# Altium schematic sheet Connectors_MILSPEC.SchDoc: Set in Document Options » Parameters » Title
size Tabloid; Author: Set in Document Options » Parameters » Author + Contact info
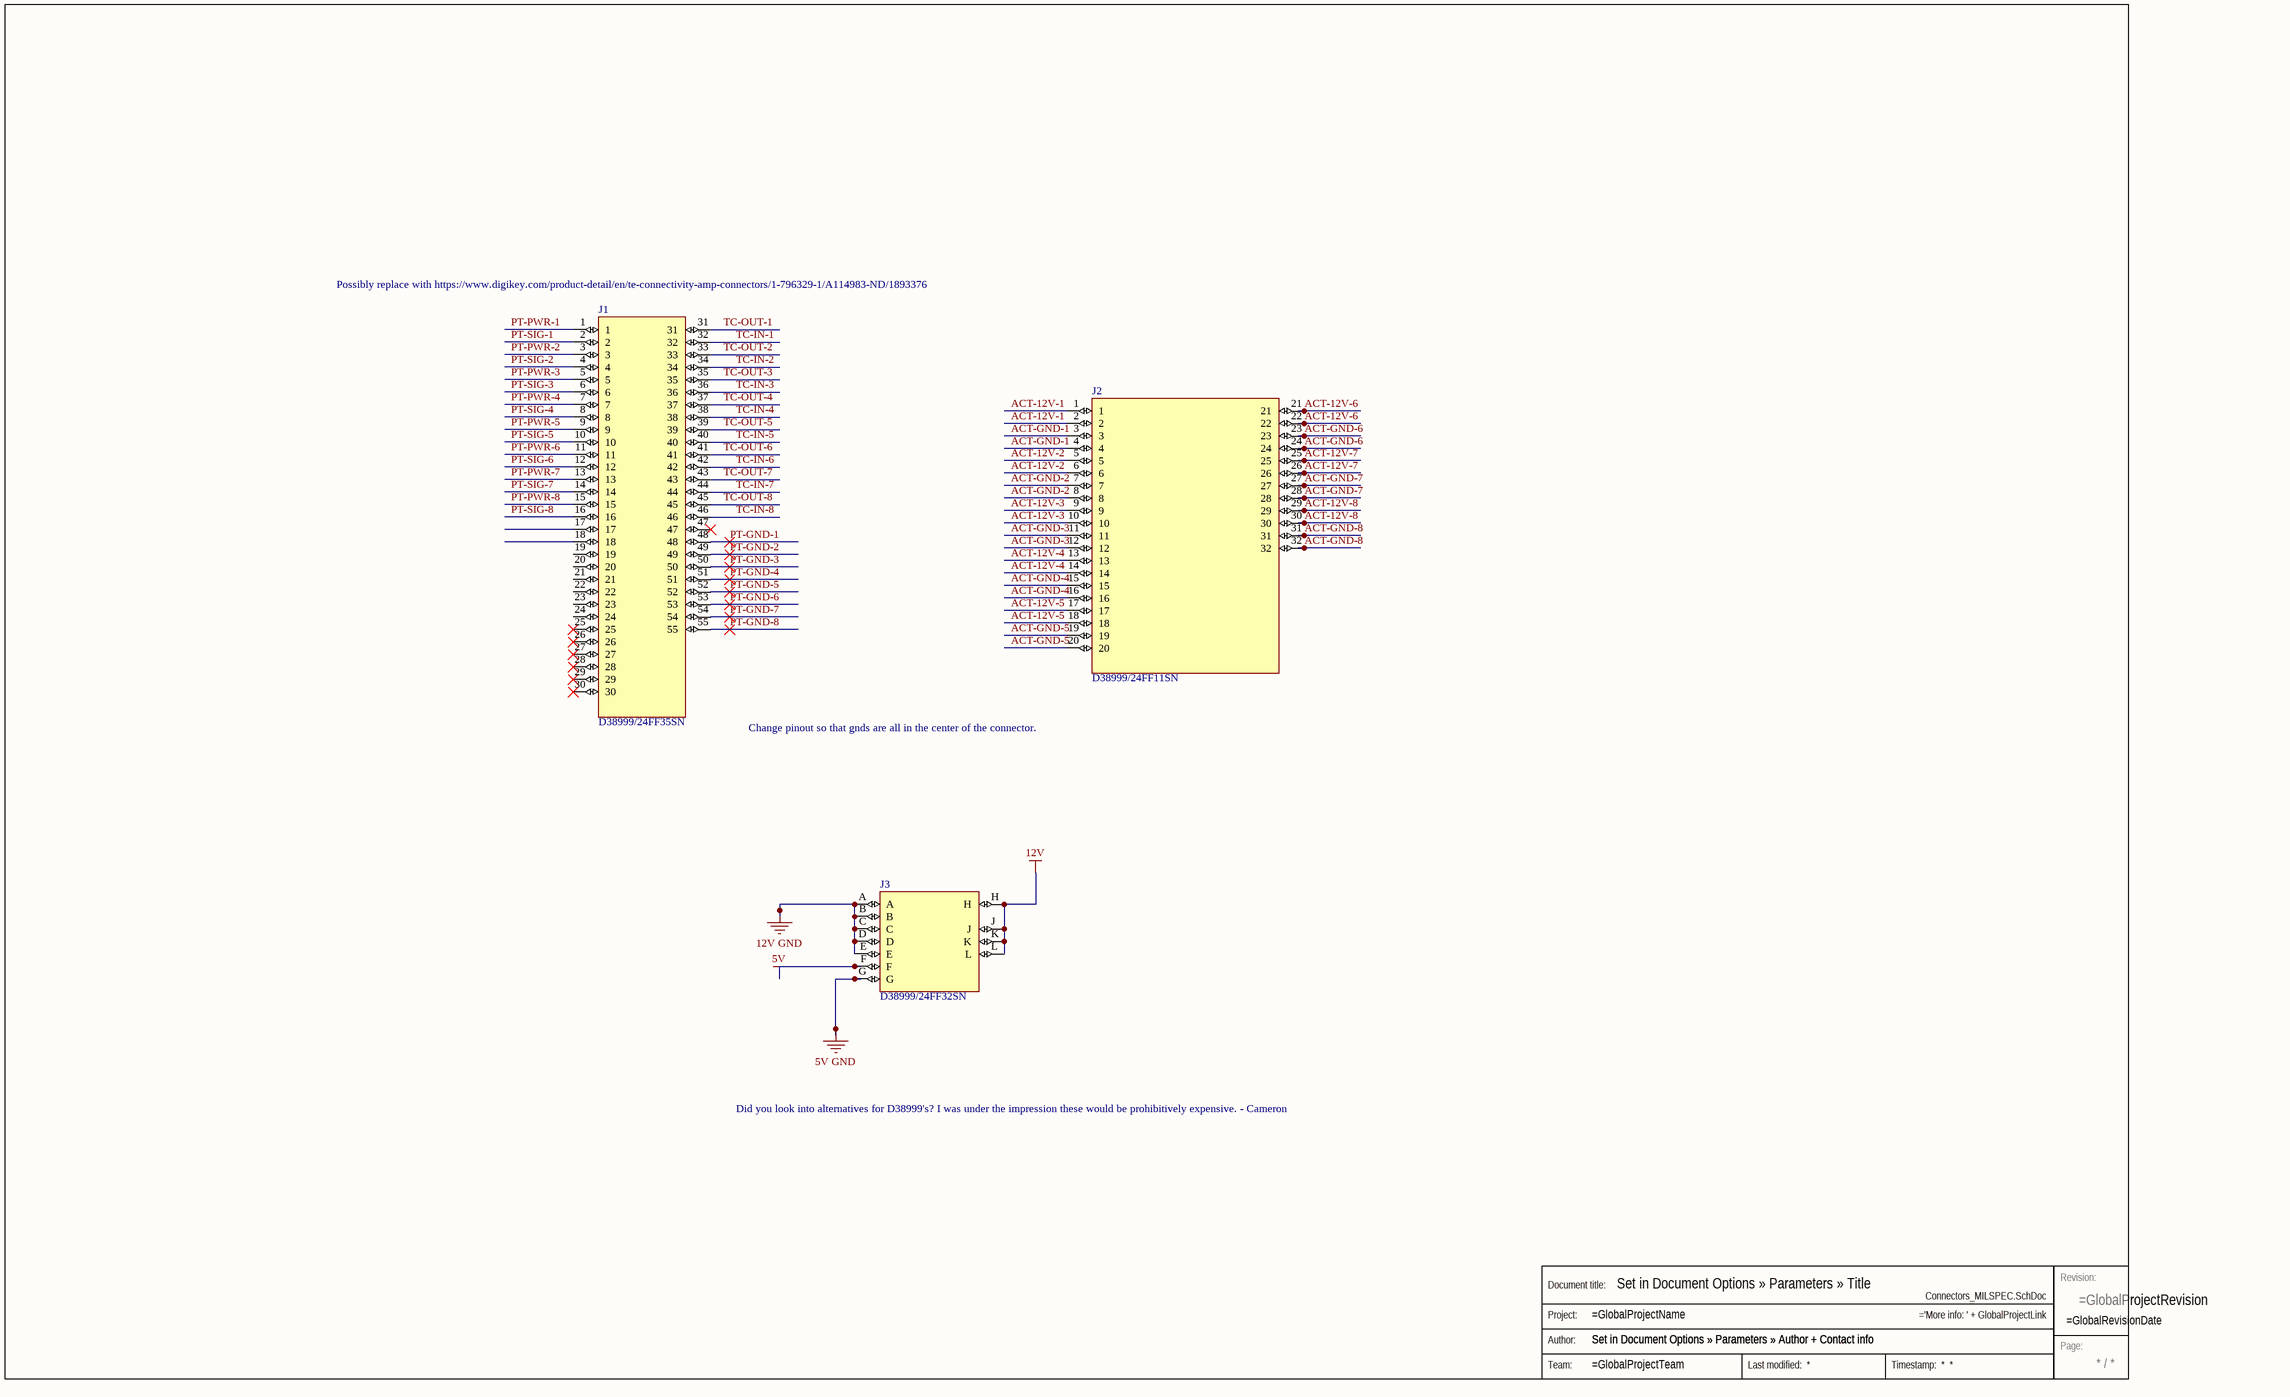
[diagram p0: Connectors_MILSPEC.SchDoc]

## Parts
J1  D38999/24FF35SN  [17-35]
J2  D38999/24FF11SN  [19-32]
J3  D38999/24FF32SN  [19-11]
Stamp  Stamp  (value not drawn)  (graphical)

## Nets
5V: J3.F
5V GND: J3.G
12V: J3.H J3.J J3.K J3.L
12V GND: J3.A J3.B J3.C J3.D J3.E
ACT-12V-1: J2.1 J2.2
ACT-12V-2: J2.5 J2.6
ACT-12V-3: J2.9 J2.10
ACT-12V-4: J2.13 J2.14
ACT-12V-5: J2.17 J2.18
ACT-12V-6: J2.21 J2.22
ACT-12V-7: J2.25 J2.26
ACT-12V-8: J2.29 J2.30
ACT-GND-1: J2.3 J2.4
ACT-GND-2: J2.7 J2.8
ACT-GND-3: J2.11 J2.12
ACT-GND-4: J2.15 J2.16
ACT-GND-5: J2.19 J2.20
ACT-GND-6: J2.23 J2.24
ACT-GND-7: J2.27 J2.28
ACT-GND-8: J2.31 J2.32
PT-GND-1: J1.48
PT-GND-2: J1.49
PT-GND-3: J1.50
PT-GND-4: J1.51
PT-GND-5: J1.52
PT-GND-6: J1.53
PT-GND-7: J1.54
PT-GND-8: J1.55
PT-PWR-1: J1.1
PT-PWR-2: J1.3
PT-PWR-3: J1.5
PT-PWR-4: J1.7
PT-PWR-5: J1.9
PT-PWR-6: J1.11
PT-PWR-7: J1.13
PT-PWR-8: J1.15
PT-SIG-1: J1.2
PT-SIG-2: J1.4
PT-SIG-3: J1.6
PT-SIG-4: J1.8
PT-SIG-5: J1.10
PT-SIG-6: J1.12
PT-SIG-7: J1.14
PT-SIG-8: J1.16
TC-IN-1: J1.32
TC-IN-2: J1.34
TC-IN-3: J1.36
TC-IN-4: J1.38
TC-IN-5: J1.40
TC-IN-6: J1.42
TC-IN-7: J1.44
TC-IN-8: J1.46
TC-OUT-1: J1.31
TC-OUT-2: J1.33
TC-OUT-3: J1.35
TC-OUT-4: J1.37
TC-OUT-5: J1.39
TC-OUT-6: J1.41
TC-OUT-7: J1.43
TC-OUT-8: J1.45

Not connected (* = marked no-connect by the designer): J1 17 18 19 20 21 22 23 24 25* 26* 27* 28* 29* 30* 47*

## Notes on the sheet
- (near J1) Possibly replace with https://www.digikey.com/product-detail/en/te-connectivity-amp-connectors/1-796329-1/A114983-ND/1893376
- Change pinout so that gnds are all in the center of the connector.
- Did you look into alternatives for D38999's? I was under the impression these would be prohibitively expensive. - Cameron
- (in symbol Stamp) Revision:; Document title:; Project:; Author:; Page:; Team:

## Library data of the parts
J1 = D38999/24FF35SN: D38999/24FE35SN